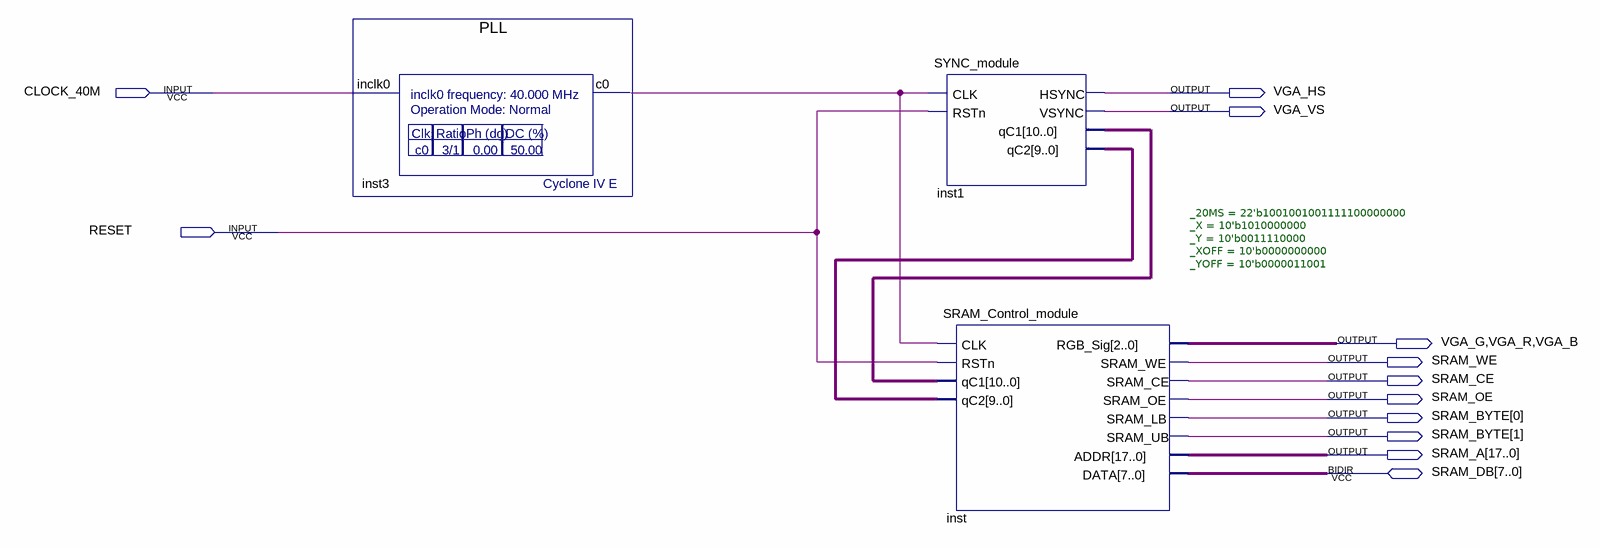
[diagram p0: schematic sheet]
// Quartus schematic SRAM.bdf as structural Verilog: 3 symbols, 12 pins
module SRAM (
  input  CLOCK_40M,
  input  RESET,
  inout  [7:0] SRAM_DB,
  output VGA_HS,
  output VGA_VS,
  output VGA_G,
  output VGA_R,
  output VGA_B,
  output SRAM_WE,
  output SRAM_CE,
  output SRAM_OE,
  output [1:0] SRAM_BYTE,
  output [17:0] SRAM_A
);

  wire inst3_c0;
  wire [9:0] inst1_qc2;
  wire [10:0] inst1_qc1;

  PLL inst3 (.inclk0(CLOCK_40M), .c0(inst3_c0));
  SYNC_module inst1 (.CLK(inst3_c0), .RSTn(RESET), .HSYNC(VGA_HS), .VSYNC(VGA_VS), .qC1(inst1_qc1), .qC2(inst1_qc2));
  SRAM_Control_module #(._20MS(22'b1001001001111100000000), ._X(10'b1010000000), ._Y(10'b0011110000), ._XOFF(10'b0000000000), ._YOFF(10'b0000011001)) inst (
    .CLK(inst3_c0), .RSTn(RESET), .qC1(inst1_qc1), .qC2(inst1_qc2), .RGB_Sig({VGA_G, VGA_R, VGA_B}),
    .SRAM_WE(SRAM_WE), .SRAM_CE(SRAM_CE), .SRAM_OE(SRAM_OE), .SRAM_LB(SRAM_BYTE[0]), .SRAM_UB(SRAM_BYTE[1]),
    .ADDR(SRAM_A), .DATA(SRAM_DB));
endmodule
